# EAGLE design HIM-Otte-server-slow-control-V1-3a (EAGLE 7.7.0)
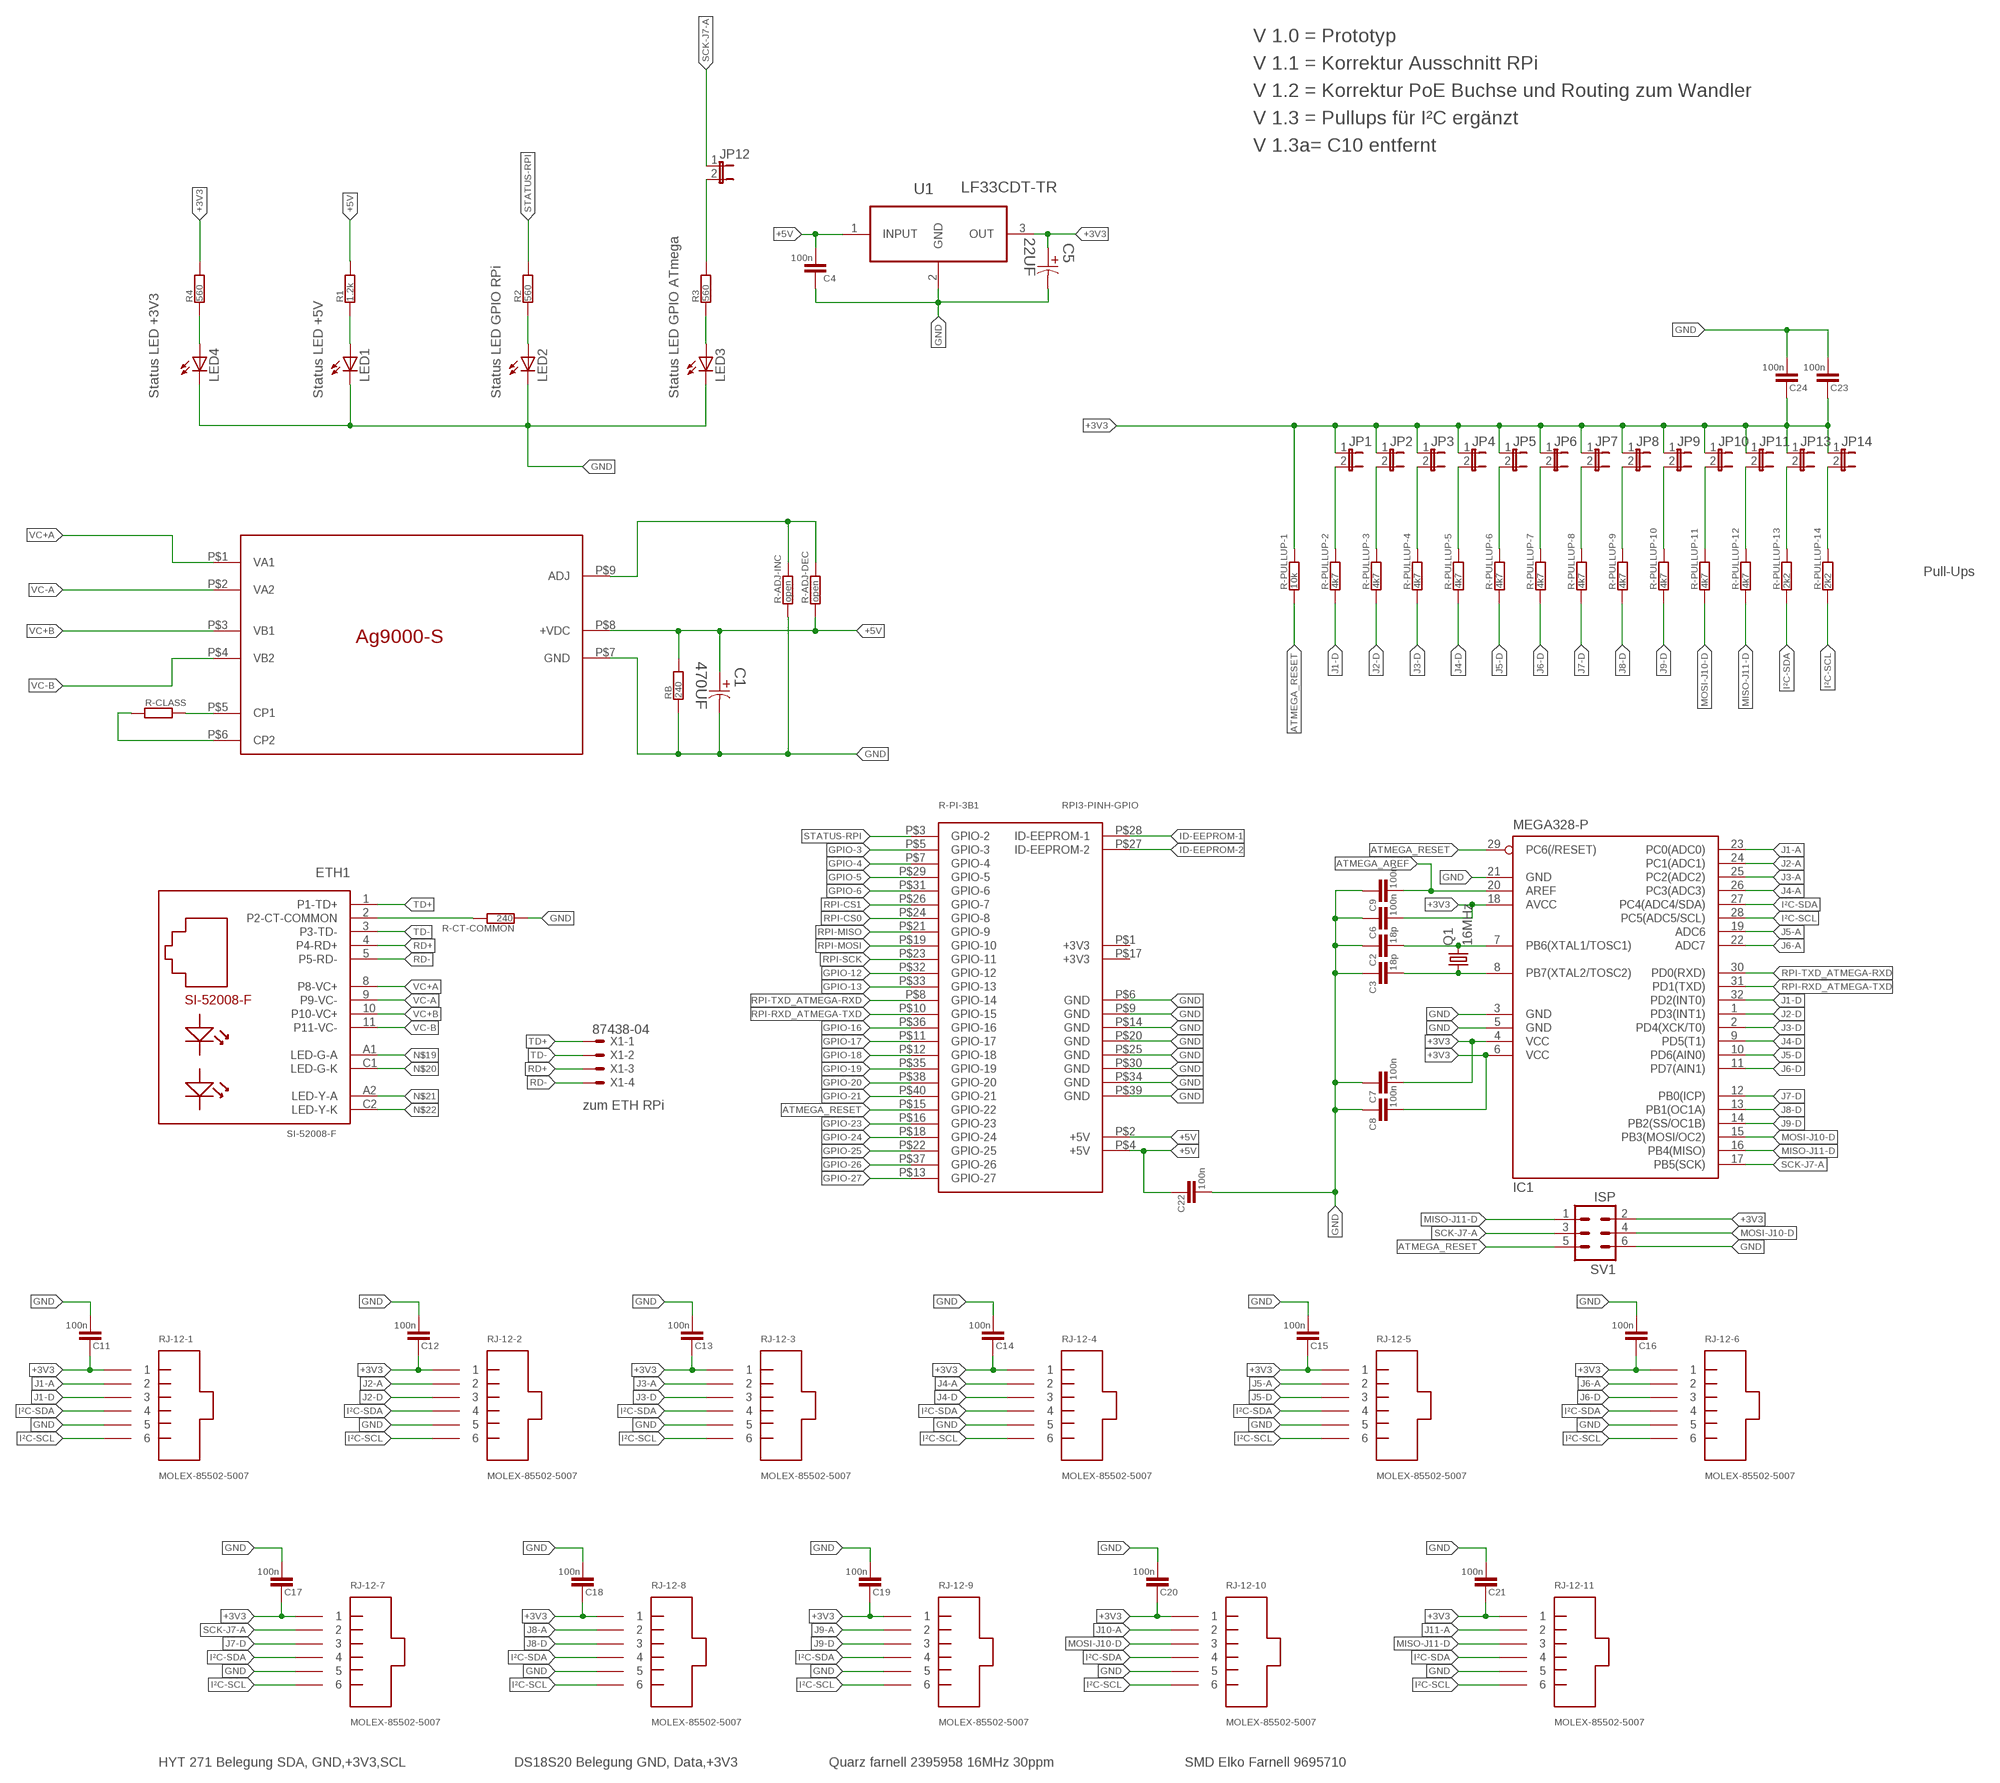
[diagram p0: schematic, sheet 1]

## Parts
C1  470UF  EEE-FK1C471P-CASE-F  [CAPAE830X1050N]
C2  18p  C-EUC0603  [C0603]
C3  18p  C-EUC0603  [C0603]
C4  100n  C-EUC0603  [C0603]
C5  22UF  EEE-FK1V220AR-CASE-C  [CAPAE530X610N]
C6  100n  C-EUC0603  [C0603]
C7  100n  C-EUC0603  [C0603]
C8  100n  C-EUC0603  [C0603]
C9  100n  C-EUC0603  [C0603]
C11  100n  C-EUC0603  [C0603]
C12  100n  C-EUC0603  [C0603]
C13  100n  C-EUC0603  [C0603]
C14  100n  C-EUC0603  [C0603]
C15  100n  C-EUC0603  [C0603]
C16  100n  C-EUC0603  [C0603]
C17  100n  C-EUC0603  [C0603]
C18  100n  C-EUC0603  [C0603]
C19  100n  C-EUC0603  [C0603]
C20  100n  C-EUC0603  [C0603]
C21  100n  C-EUC0603  [C0603]
C22  100n  C-EUC0603  [C0603]
C23  100n  C-EUC0603  [C0603]
C24  100n  C-EUC0603  [C0603]
ETH1  SI-52008-F  [SI-52008-F]
IC1  MEGA328-P  MEGA8-AI  [TQFP32-08]
JP1  JP1E  [JP1]
JP2  JP1E  [JP1]
JP3  JP1E  [JP1]
JP4  JP1E  [JP1]
JP5  JP1E  [JP1]
JP6  JP1E  [JP1]
JP7  JP1E  [JP1]
JP8  JP1E  [JP1]
JP9  JP1E  [JP1]
JP10  JP1E  [JP1]
JP11  JP1E  [JP1]
JP12  JP1E  [JP1]
JP13  JP1E  [JP1]
JP14  JP1E  [JP1]
LED1  LEDCHIPLED_0603  [CHIPLED_0603]
LED2  LEDCHIPLED_0603  [CHIPLED_0603]
LED3  LEDCHIPLED_0603  [CHIPLED_0603]
LED4  LEDCHIPLED_0603  [CHIPLED_0603]
Q1  16MHz  CRYSTALHC49UP  [HC49UP]
R1  1.2k  R-EU_R0603  [R0603]
R2  560  R-EU_R0603  [R0603]
R3  560  R-EU_R0603  [R0603]
R4  560  R-EU_R0603  [R0603]
R-ADJ-DEC  open  R-EU_R0603  [R0603]
R-ADJ-INC  open  R-EU_R0603  [R0603]
R-CLASS  R-EU_R0603  [R0603]
R-CT-COMMON  240  R-EU_R0603  [R0603]
R-PI-3B1  RPI3-PINH-GPIO  [RPI3-PINH-GPIO]
R-PULLUP-1  10k  R-EU_R0603  [R0603]
R-PULLUP-2  4k7  R-EU_R0603  [R0603]
R-PULLUP-3  4k7  R-EU_R0603  [R0603]
R-PULLUP-4  4k7  R-EU_R0603  [R0603]
R-PULLUP-5  4k7  R-EU_R0603  [R0603]
R-PULLUP-6  4k7  R-EU_R0603  [R0603]
R-PULLUP-7  4k7  R-EU_R0603  [R0603]
R-PULLUP-8  4k7  R-EU_R0603  [R0603]
R-PULLUP-9  4k7  R-EU_R0603  [R0603]
R-PULLUP-10  4k7  R-EU_R0603  [R0603]
R-PULLUP-11  4k7  R-EU_R0603  [R0603]
R-PULLUP-12  4k7  R-EU_R0603  [R0603]
R-PULLUP-13  2k2  R-EU_R0603  [R0603]
R-PULLUP-14  2k2  R-EU_R0603  [R0603]
RB  240  R-EU_R0603  [R0603]
RJ-12-1  MOLEX-85502-5007  [MOLEX-85502-5007]
RJ-12-2  MOLEX-85502-5007  [MOLEX-85502-5007]
RJ-12-3  MOLEX-85502-5007  [MOLEX-85502-5007]
RJ-12-4  MOLEX-85502-5007  [MOLEX-85502-5007]
RJ-12-5  MOLEX-85502-5007  [MOLEX-85502-5007]
RJ-12-6  MOLEX-85502-5007  [MOLEX-85502-5007]
RJ-12-7  MOLEX-85502-5007  [MOLEX-85502-5007]
RJ-12-8  MOLEX-85502-5007  [MOLEX-85502-5007]
RJ-12-9  MOLEX-85502-5007  [MOLEX-85502-5007]
RJ-12-10  MOLEX-85502-5007  [MOLEX-85502-5007]
RJ-12-11  MOLEX-85502-5007  [MOLEX-85502-5007]
SV1  ISP  ML6  [ML6]
U1  LF33CDT-TR  [TO228P972X240-3N]
U$1  AG9000-S  [AG9000-S]
X1  87438-04  [87438-04]

## Nets
+3V3: C5.1 C6.2 C7.2 C8.2 C11.1 C12.1 C13.1 C14.1 C15.1 C16.1 C17.1 C18.1 C19.1 C20.1 C21.1 C23.1 C24.1 IC1.4(VCC) IC1.6(VCC) IC1.18(AVCC) JP1.1 JP2.1 JP3.1 JP4.1 JP5.1 JP6.1 JP7.1 JP8.1 JP9.1 JP10.1 JP11.1 JP13.1 JP14.1 R4.2 R-PULLUP-1.2 RJ-12-1.1 RJ-12-2.1 RJ-12-3.1 RJ-12-4.1 RJ-12-5.1 RJ-12-6.1 RJ-12-7.1 RJ-12-8.1 RJ-12-9.1 RJ-12-10.1 RJ-12-11.1 SV1.2 U1.3(OUT)
+5V: C1.1 C4.2 C22.1 R1.2 R-ADJ-DEC.1 R-PI-3B1.P$2(+5V) R-PI-3B1.P$4(+5V) RB.2 U1.1(INPUT) U$1.P$8(+VDC)
ATMEGA_AREF: C9.2 IC1.20(AREF)
ATMEGA_RESET: IC1.29(PC6(/RESET)) R-PI-3B1.P$15(GPIO-22) R-PULLUP-1.1 SV1.5
GND: C1.2 C2.1 C3.1 C4.1 C5.2 C6.1 C7.1 C8.1 C9.1 C11.2 C12.2 C13.2 C14.2 C15.2 C16.2 C17.2 C18.2 C19.2 C20.2 C21.2 C22.2 C23.2 C24.2 IC1.3(GND) IC1.5(GND) IC1.21(GND) LED1.C LED2.C LED3.C LED4.C R-ADJ-INC.1 R-CT-COMMON.1 R-PI-3B1.P$6(GND) R-PI-3B1.P$9(GND) R-PI-3B1.P$14(GND) R-PI-3B1.P$20(GND) R-PI-3B1.P$25(GND) R-PI-3B1.P$30(GND) R-PI-3B1.P$34(GND) R-PI-3B1.P$39(GND) RB.1 RJ-12-1.5 RJ-12-2.5 RJ-12-3.5 RJ-12-4.5 RJ-12-5.5 RJ-12-6.5 RJ-12-7.5 RJ-12-8.5 RJ-12-9.5 RJ-12-10.5 RJ-12-11.5 SV1.6 U1.2(GND) U$1.P$7(GND)
GPIO-3: R-PI-3B1.P$5(GPIO-3)
GPIO-4: R-PI-3B1.P$7(GPIO-4)
GPIO-5: R-PI-3B1.P$29(GPIO-5)
GPIO-6: R-PI-3B1.P$31(GPIO-6)
GPIO-12: R-PI-3B1.P$32(GPIO-12)
GPIO-13: R-PI-3B1.P$33(GPIO-13)
GPIO-16: R-PI-3B1.P$36(GPIO-16)
GPIO-17: R-PI-3B1.P$11(GPIO-17)
GPIO-18: R-PI-3B1.P$12(GPIO-18)
GPIO-19: R-PI-3B1.P$35(GPIO-19)
GPIO-20: R-PI-3B1.P$38(GPIO-20)
GPIO-21: R-PI-3B1.P$40(GPIO-21)
GPIO-23: R-PI-3B1.P$16(GPIO-23)
GPIO-24: R-PI-3B1.P$18(GPIO-24)
GPIO-25: R-PI-3B1.P$22(GPIO-25)
GPIO-26: R-PI-3B1.P$37(GPIO-26)
GPIO-27: R-PI-3B1.P$13(GPIO-27)
ID-EEPROM-1: R-PI-3B1.P$28(ID-EEPROM-1)
ID-EEPROM-2: R-PI-3B1.P$27(ID-EEPROM-2)
I²C-SCL: IC1.28(PC5(ADC5/SCL)) R-PULLUP-14.1 RJ-12-1.6 RJ-12-2.6 RJ-12-3.6 RJ-12-4.6 RJ-12-5.6 RJ-12-6.6 RJ-12-7.6 RJ-12-8.6 RJ-12-9.6 RJ-12-10.6 RJ-12-11.6
I²C-SDA: IC1.27(PC4(ADC4/SDA)) R-PULLUP-13.1 RJ-12-1.4 RJ-12-2.4 RJ-12-3.4 RJ-12-4.4 RJ-12-5.4 RJ-12-6.4 RJ-12-7.4 RJ-12-8.4 RJ-12-9.4 RJ-12-10.4 RJ-12-11.4
J1-A: IC1.23(PC0(ADC0)) RJ-12-1.2
J1-D: IC1.32(PD2(INT0)) R-PULLUP-2.1 RJ-12-1.3
J2-A: IC1.24(PC1(ADC1)) RJ-12-2.2
J2-D: IC1.1(PD3(INT1)) R-PULLUP-3.1 RJ-12-2.3
J3-A: IC1.25(PC2(ADC2)) RJ-12-3.2
J3-D: IC1.2(PD4(XCK/T0)) R-PULLUP-4.1 RJ-12-3.3
J4-A: IC1.26(PC3(ADC3)) RJ-12-4.2
J4-D: IC1.9(PD5(T1)) R-PULLUP-5.1 RJ-12-4.3
J5-A: IC1.19(ADC6) RJ-12-5.2
J5-D: IC1.10(PD6(AIN0)) R-PULLUP-6.1 RJ-12-5.3
J6-A: IC1.22(ADC7) RJ-12-6.2
J6-D: IC1.11(PD7(AIN1)) R-PULLUP-7.1 RJ-12-6.3
J7-D: IC1.12(PB0(ICP)) R-PULLUP-8.1 RJ-12-7.3
J8-A: RJ-12-8.2
J8-D: IC1.13(PB1(OC1A)) R-PULLUP-9.1 RJ-12-8.3
J9-A: RJ-12-9.2
J9-D: IC1.14(PB2(SS/OC1B)) R-PULLUP-10.1 RJ-12-9.3
J10-A: RJ-12-10.2
J11-A: RJ-12-11.2
MISO-J11-D: IC1.16(PB4(MISO)) R-PULLUP-12.1 RJ-12-11.3 SV1.1
MOSI-J10-D: IC1.15(PB3(MOSI/OC2)) R-PULLUP-11.1 RJ-12-10.3 SV1.4
N$1: JP11.2 R-PULLUP-12.2
N$2: JP10.2 R-PULLUP-11.2
N$3: JP9.2 R-PULLUP-10.2
N$4: JP8.2 R-PULLUP-9.2
N$5: R-CLASS.2 U$1.P$5(CP1)
N$6: R-CLASS.1 U$1.P$6(CP2)
N$7: R-ADJ-DEC.2 R-ADJ-INC.2 U$1.P$9(ADJ)
N$8: C2.2 IC1.7(PB6(XTAL1/TOSC1)) Q1.2
N$9: C3.2 IC1.8(PB7(XTAL2/TOSC2)) Q1.1
N$10: JP7.2 R-PULLUP-8.2
N$11: ETH1.2(P2-CT-COMMON) R-CT-COMMON.2
N$12: JP6.2 R-PULLUP-7.2
N$13: JP5.2 R-PULLUP-6.2
N$14: JP4.2 R-PULLUP-5.2
N$15: JP3.2 R-PULLUP-4.2
N$16: JP2.2 R-PULLUP-3.2
N$17: JP1.2 R-PULLUP-2.2
N$18: LED4.A R4.1
N$19: ETH1.A1(LED-G-A)
N$20: ETH1.C1(LED-G-K)
N$21: ETH1.A2(LED-Y-A)
N$22: ETH1.C2(LED-Y-K)
N$23: JP12.2 R3.2
N$24: JP13.2 R-PULLUP-13.2
N$25: JP14.2 R-PULLUP-14.2
N$56: LED1.A R1.1
N$57: LED2.A R2.1
N$58: LED3.A R3.1
RD+: ETH1.4(P4-RD+) X1.3
RD-: ETH1.5(P5-RD-) X1.4
RPI-CS0: R-PI-3B1.P$24(GPIO-8)
RPI-CS1: R-PI-3B1.P$26(GPIO-7)
RPI-MISO: R-PI-3B1.P$21(GPIO-9)
RPI-MOSI: R-PI-3B1.P$19(GPIO-10)
RPI-RXD_ATMEGA-TXD: IC1.31(PD1(TXD)) R-PI-3B1.P$10(GPIO-15)
RPI-SCK: R-PI-3B1.P$23(GPIO-11)
RPI-TXD_ATMEGA-RXD: IC1.30(PD0(RXD)) R-PI-3B1.P$8(GPIO-14)
SCK-J7-A: IC1.17(PB5(SCK)) JP12.1 RJ-12-7.2 SV1.3
STATUS-RPI: R2.2 R-PI-3B1.P$3(GPIO-2)
TD+: ETH1.1(P1-TD+) X1.1
TD-: ETH1.3(P3-TD-) X1.2
VC+A: ETH1.8(P8-VC+) U$1.P$1(VA1)
VC+B: ETH1.10(P10-VC+) U$1.P$3(VB1)
VC-A: ETH1.9(P9-VC-) U$1.P$2(VA2)
VC-B: ETH1.11(P11-VC-) U$1.P$4(VB2)
Unconnected: R-PI-3B1.P$1(+3V3) R-PI-3B1.P$17(+3V3)

## Notes on the sheet
- V 1.0 = Prototyp
- V 1.1 = Korrektur Ausschnitt RPi
- V 1.2 = Korrektur PoE Buchse und Routing zum Wandler
- V 1.3 = Pullups für I²C ergänzt
- V 1.3a= C10 entfernt
- Status LED +3V3 | Status LED +5V | Status LED GPIO RPi | Status LED GPIO ATmega
- Pull-Ups
- zum ETH RPi
- HYT 271 Belegung SDA, GND,+3V3,SCL | DS18S20 Belegung GND, Data,+3V3 | Quarz farnell 2395958 16MHz 30ppm | SMD Elko Farnell 9695710

## Library data of the parts
C1 = Panasonic-EEEFK_EEEFP:EEE-: Aluminum Electrolytic Capacitors,Surface Mount Type; MPN: EEE-FK1C471P; OC_FARNELL: 9695710; OC_NEWARK: 96K9385; PACKAGE: CASE-F; SUPPLIER: PANASONIC; TOLERANCE: ±20 %; VOLTAGERATING: 16V
C2-C4 C6-C9 C11-C24 = KPH-RCL:C-EU: CAPACITOR, European symbol; DIELECTRICUM: X7R; HEIGHT: 0.6; TK: 100ppm; TOLERANCE: 10%; VOLTAGE: 16V
C5 = KPH-Panasonic-Elkos-SMD:EEE-: Aluminum Electrolytic Capacitors,Surface Mount Type; MPN: EEE-FK1V220AR; OC_FARNELL: 1244422; OC_NEWARK: 12M9846; PACKAGE: CASE-C; SUPPLIER: PANASONIC; TOLERANCE: ±20 %; VOLTAGERATING: 35V
ETH1 = KPH-con-stewart:SI-52008-F
IC1 = atmel:MEGA8: MICROCONTROLLER 8 Kbytes FLASH, 1 kbytes SRAM, 512 bytes EEPROM, USART, 6-channel 10 bit ADC, 2-channel 8 bit ADC Pin compatible with Atmega48, ATMega88, ATMega168 Source: avr.lbr; MPN: ATMEGA8-16AU; OC_FARNELL: 9171371; OC_NEWARK: 73M8863
JP1-JP14 = jumper:JP1E: JUMPER
LED1-LED4 = led:LED: LED OSRAM: - CHIPLED LG R971, LG N971, LY N971, LG Q971, LY Q971, LO R971, LY R971 LH N974, LH R974 LS Q976, LO Q976, LY Q976 LO Q996 - Hyper CHIPLED LW Q18S LB Q993, LB Q99A, LB R99A - SideLED LS A670, LO A670, LY A670, LG A670, LP A670 LB A673, LV A673, LT A673, LW A673 LH A674 LY A675 LS A676, LA A676, LO A676, LY A676, LW A676 LS A679, LY A679, LG A679 - Hyper Micro SIDELED® LS Y876, LA Y876, LO Y876, LY Y876 LT Y87S - SmartLED LW L88C, LW L88S LB L89C, LB L89S, LG L890 LS L89K, LO L89K, LY L89K LS L896, LA L896, LO L896, LY L896 - TOPLED LS T670, LO T670, LY T670, LG T670, LP T670 LSG T670, LSP T670, LSY T670, LOP T670, LYG T670 LG T671, LOG T671, LSG T671 LB T673, LV T673, LT T673, LW T673 LH T674 LS T676, LA T676, LO T676, LY T676, LB T676, LH T676, LSB T676, LW T676 LB T67C, LV T67C, LT T67C, LS T67K, LO T67K, LY T67K, LW E67C LS E67B, LA E67B, LO E67B, LY E67B, LB E67C, LV E67C, LT E67C LW T67C LS T679, LY T679, LG T679 LS T770, LO T770, LY T770, LG T770, LP T770 LB T773, LV T773, LT T773, LW T773 LH T774 LS E675, LA E675, LY E675, LS T675 LS T776, LA T776, LO T776, LY T776, LB T776 LHGB T686 LT T68C, LB T68C - Hyper Mini TOPLED® LB M676 - Mini TOPLED Santana® LG M470 LS M47K, LO M47K, LY M47K Source: http://www.osram.convergy.de LUXEON: - LUMILED® LXK2-PW12-R00, LXK2-PW12-S00, LXK2-PW14-U00, LXK2-PW14-V00 LXK2-PM12-R00, LXK2-PM12-S00, LXK2-PM14-U00 LXK2-PE12-Q00, LXK2-PE12-R00, LXK2-PE12-S00, LXK2-PE14-T00, LXK2-PE14-U00 LXK2-PB12-K00, LXK2-PB12-L00, LXK2-PB12-M00, LXK2-PB14-N00, LXK2-PB14-P00, LXK2-PB14-Q00 LXK2-PR12-L00, LXK2-PR12-M00, LXK2-PR14-Q00, LXK2-PR14-R00 LXK2-PD12-Q00, LXK2-PD12-R00, LXK2-PD12-S00 LXK2-PH12-R00, LXK2-PH12-S00 LXK2-PL12-P00, LXK2-PL12-Q00, LXK2-PL12-R00 Source: www.luxeon.com KINGBRIGHT: KA-3528ASYC Source: www.kingbright.com
Q1 = crystal:CRYSTAL: CRYSTAL; OC_FARNELL: unknown; OC_NEWARK: unknown
R1-R4 R-ADJ-DEC R-ADJ-INC R-CLASS R-CT-COMMON R-PULLUP-1-R-PULLUP-14 RB = KPH-RCL:R-EU_: RESISTOR, European symbol; HEIGHT: 0.2; TK: 100ppm; TOLERANCE: 1%
R-PI-3B1 = KPH-Raspberry:RPI3-PINH-GPIO
RJ-12-1-RJ-12-11 = RJ12:MOLEX-85502-5007
SV1 = con-harting-ml:ML6: HARTING; OC_FARNELL: unknown; OC_NEWARK: unknown
U1 = KPH-V-REG:LF33CDT-TR: LDO, REG, 16VIN, 3.3V, 1A, D-PAK-3; MPN: LF33CDT-TR; OC_FARNELL: 2112623; OC_NEWARK: 89K1285; PACKAGE: DPAK; SUPPLIER: STMicroelectronics
U$1 = KPH-PoE-Netzteil:AG9000-S: PoE Ag9000-S
X1 = con-molex:87438-04: Wire-to-Board 1.50mm (.059") Pitch Header - Right Angle, SMT, Shrouded Source: http://www.molex.com/product/micro/87438.html; OC_FARNELL: unknown; OC_NEWARK: unknown

## Net classes
0 default: width 0.4 mm, drill 0.6 mm, clearance 0.2 mm

## Board
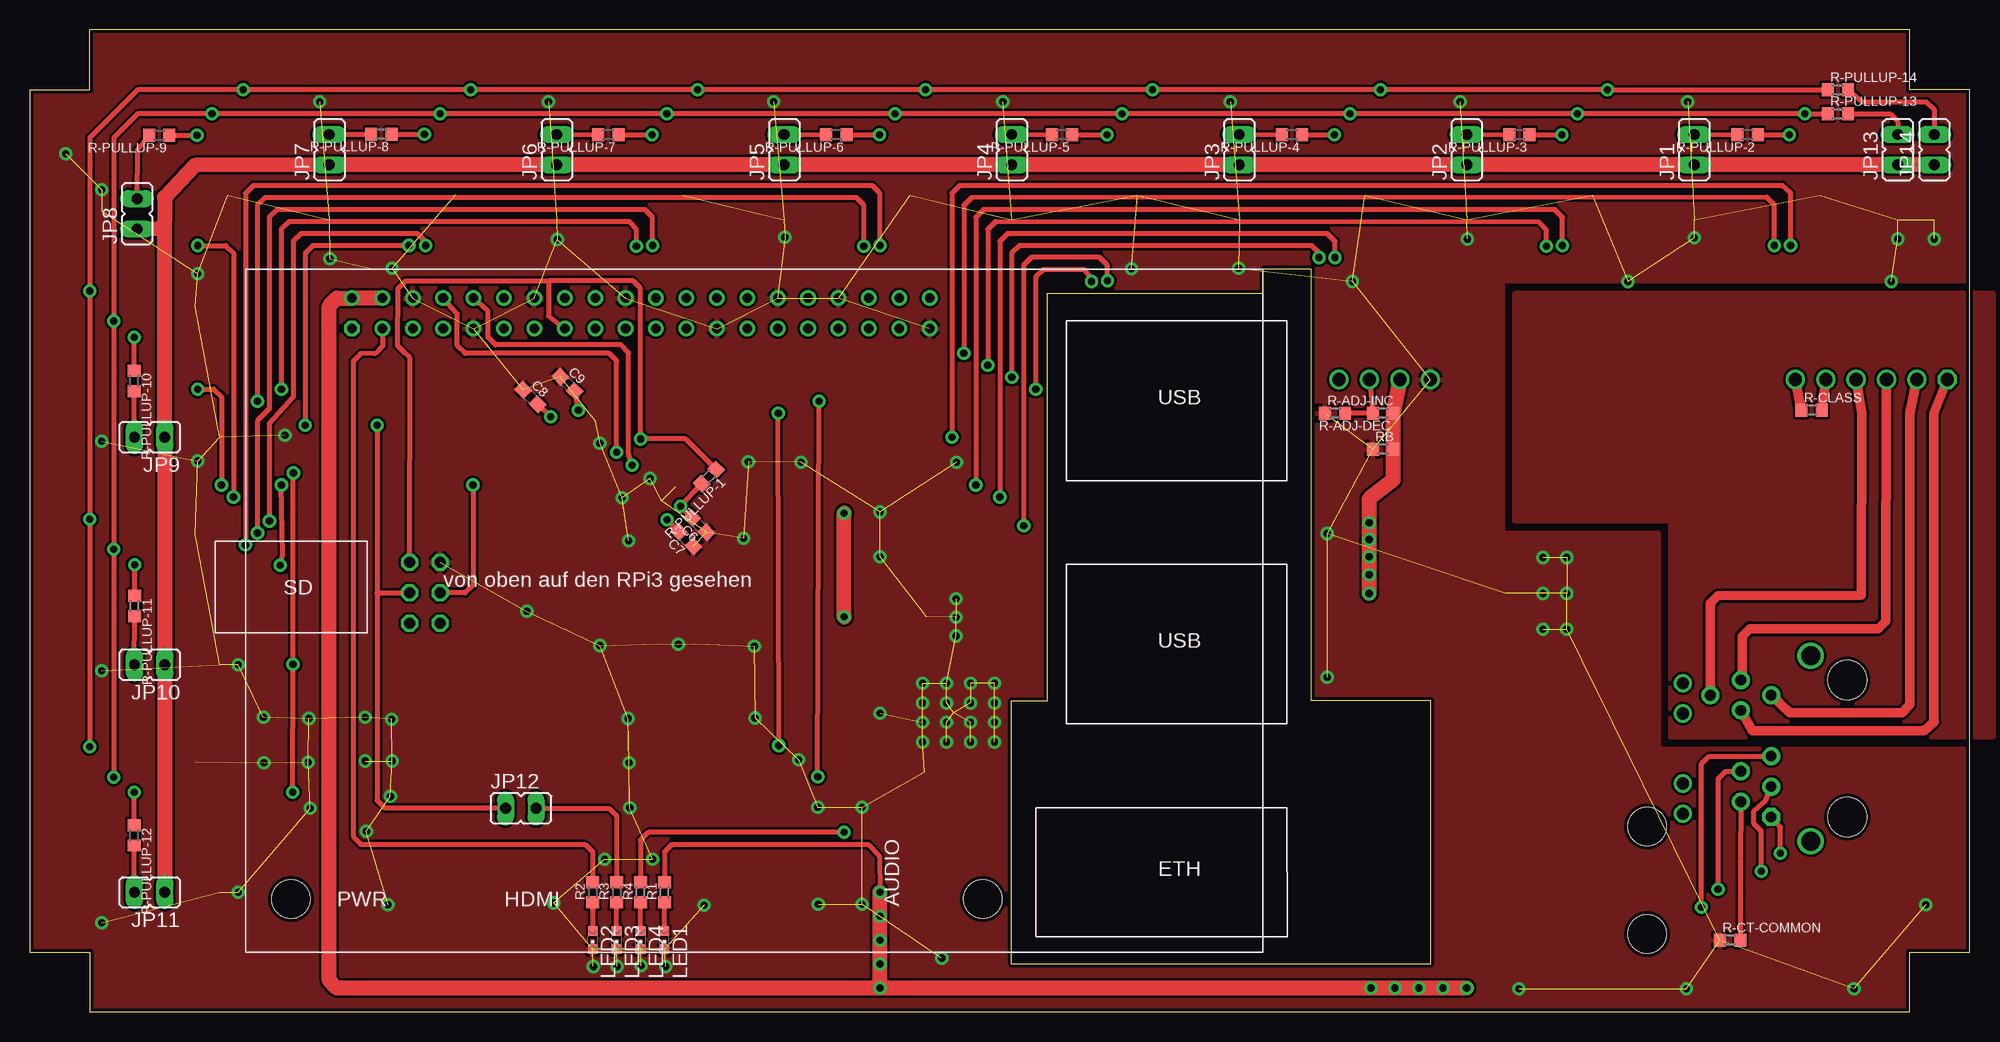
[diagram p1: board, top side]
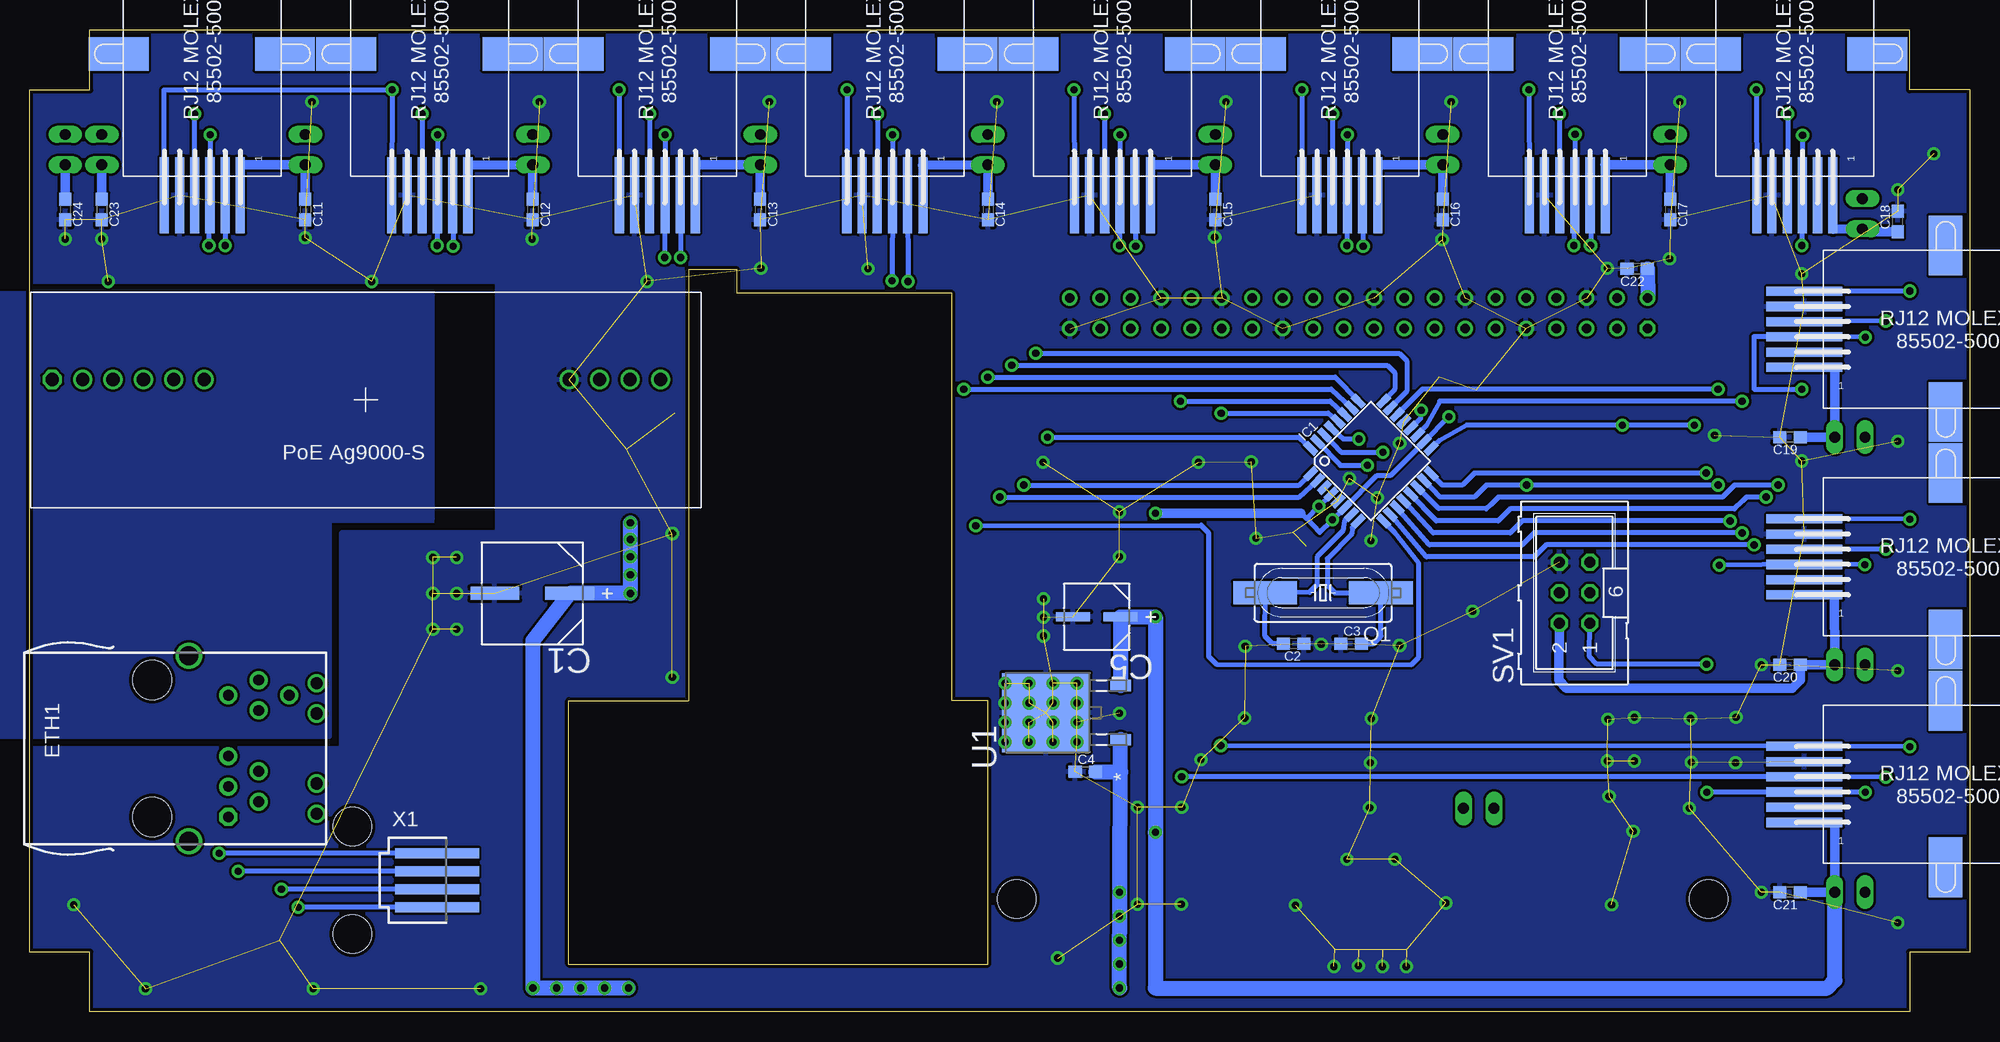
[diagram p2: board, bottom side, seen from below]

Size 162 x 82 mm. Coordinates in mm from the lower left corner, seen from the top.
Outline: 5,0 157,0 157,5 162,5 162,77 157,77 157,82 5,82 5,77 0,77 0,5 5,5 5,0
Outline: 82,4 82,26 85,26 85,60 103,60 103,62 107,62 107,26 117,26 117,4 82,4
Copper layers (1*16): Top 0.035mm / dielectric 1.5mm / Bottom 0.035mm
Design rules "LPKF": minimum track width 0.15mm, minimum drill 0.5mm, track to track 0.21mm, track to pad 0.21mm, pad to pad 0.15mm, via to via 0.21mm, smd to smd 0.15mm, copper to edge 0.3mm, drill to drill 0.2mm, minimum pad ring 0.25mm, minimum via ring 0.25mm, stop-mask expansion 0.075mm, vias tented up to drill 0mil, thermal gap 0.25mm
Holes 3.2 mm at 135.05,15.5 135.05,6.5
bRestrict: area 124,41 to 128,60

### Footprints (pad centres in the part's own frame; a part is rotated, then mirrored left to right if it is on the bottom)
CAPAE830X1050N = smd 4.064 x 1.092: 1 -3.124,0; 2 3.124,0
C0603 = smd 1.1 x 1: 1 -0.85,0; 2 0.85,0
CAPAE530X610N = smd 2.87 x 0.762: 1 -1.981,0; 2 1.981,0
SI-52008-F = drill 0.9 pad 1.5 octagon: 1 5.715,4.572 | drill 0.9 pad 1.5: 2 4.445,7.112; 3 3.175,4.572; 4 1.905,7.112; 5 0.635,4.572; 8 -3.175,7.112; 9 -4.445,4.572; 10 -5.715,7.112; 11 -4.445,9.652 | drill 1.016 pad 1.5: A1 -5.461,11.938; A2 2.921,11.938; C1 -2.921,11.938; C2 5.461,11.938 | drill 1.6 pad 2.2: S1 -7.747,1.27; S2 7.747,1.27 | hole 3.251: -5.715,-1.778; 5.715,-1.778
TQFP32-08 = smd 1.27 x 0.559: 1 -4.293,2.8; 2 -4.293,2; 3 -4.293,1.2; 4 -4.293,0.4; 5 -4.293,-0.4; 6 -4.293,-1.2; 7 -4.293,-2; 8 -4.293,-2.8; 17 4.293,-2.8; 18 4.293,-2; 19 4.293,-1.2; 20 4.293,-0.4; 21 4.293,0.4; 22 4.293,1.2; 23 4.293,2; 24 4.293,2.8 | smd 0.559 x 1.27: 9 -2.8,-4.293; 10 -2,-4.293; 11 -1.2,-4.293; 12 -0.4,-4.293; 13 0.4,-4.293; 14 1.2,-4.293; 15 2,-4.293; 16 2.8,-4.293; 25 2.8,4.293; 26 2,4.293; 27 1.2,4.293; 28 0.4,4.293; 29 -0.4,4.293; 30 -1.2,4.293; 31 -2,4.293; 32 -2.8,4.293
JP1 = drill 0.914 long: 1 0,-1.27; 2 0,1.27
CHIPLED_0603 = smd 0.8 x 0.8: A 0,-0.75; C 0,0.75
HC49UP = smd 5.334 x 1.93: 1 -4.826,0; 2 4.826,0
R0603 = smd 1 x 1.1: 1 -0.85,0; 2 0.85,0
RPI3-PINH-GPIO = drill 0.8 octagon: P$1 8.89,52.07 | drill 0.8: P$2 8.89,54.61; P$3 11.43,52.07; P$4 11.43,54.61; P$5 13.97,52.07; P$6 13.97,54.61; P$7 16.51,52.07; P$8 16.51,54.61; P$9 19.05,52.07; P$10 19.05,54.61; P$11 21.59,52.07; P$12 21.59,54.61; P$13 24.13,52.07; P$14 24.13,54.61; P$15 26.67,52.07; P$16 26.67,54.61; P$17 29.21,52.07; P$18 29.21,54.61; P$19 31.75,52.07; P$20 31.75,54.61; P$21 34.29,52.07; P$22 34.29,54.61; P$23 36.83,52.07; P$24 36.83,54.61; P$25 39.37,52.07; P$26 39.37,54.61; P$27 41.91,52.07; P$28 41.91,54.61; P$29 44.45,52.07; P$30 44.45,54.61; P$31 46.99,52.07; P$32 46.99,54.61; P$33 49.53,52.07; P$34 49.53,54.61; P$35 52.07,52.07; P$36 52.07,54.61; P$37 54.61,52.07; P$38 54.61,54.61; P$39 57.15,52.07; P$40 57.15,54.61 | hole 3.2: 3.81,4.445; 61.595,4.445
MOLEX-85502-5007 = smd 6.35 x 0.76: 1 8.8,3.175; 2 8.8,1.905; 3 8.8,0.635; 4 8.8,-0.635; 5 8.8,-1.905; 6 8.8,-3.175 | smd 2.8 x 5: 7 -3,6.9; 8 -3,-7
ML6 = drill 0.914 octagon: 1 -2.54,-1.27; 2 -2.54,1.27; 3 0,-1.27; 4 0,1.27; 5 2.54,-1.27; 6 2.54,1.27
TO228P972X240-3N = smd 0.94 x 1.702: 1 -2.261,-6.096; 3 2.261,-6.096 | smd 6.604 x 7.315: 2 0,0.152
AG9000-S = drill 1.1 octagon: P$1 -26.14,1.81 | drill 1.1: P$2 -23.6,1.81; P$3 -21.06,1.81; P$4 -18.52,1.81; P$5 -15.98,1.81; P$6 -13.44,1.81; P$7 17.04,1.81; P$8 19.58,1.81; P$9 22.12,1.81; P$10 24.66,1.81
87438-04 = smd 7 x 0.85: 1 0,2.25; 2 0,0.75; 3 0,-0.75; 4 0,-2.25

### Placement (x,y rotation side)
C1  120.05,34.95 180 bottom
C2  56.45,30.75 180 bottom
C3  51.65,30.75 0 bottom
C4  73.85,20.05 0 bottom
C5  72.9,33 180 bottom
C6  55.9,40.65 135 top
C7  54.8,39.5 135 top
C8  41.8,51.35 315 top
C9  44.9,52.45 315 top
C11  139,67 270 bottom
C12  120,67 270 bottom
C13  101,67 270 bottom
C14  82,67 270 bottom
C15  63,67 270 bottom
C16  44,67 270 bottom
C17  25,67 270 bottom
C18  6,66 90 bottom
C19  15,48 180 bottom
C20  15,29 180 bottom
C21  15,10 180 bottom
C22  27.75,62.05 180 bottom
C23  156,67 270 bottom
C24  159.05,67 270 bottom
ETH1  150,22 270 bottom
IC1  50,46 45 bottom
JP1  139,72 0 top
JP2  120,72 0 top
JP3  101,72 0 top
JP4  82,72 0 top
JP5  63,72 0 top
JP6  44,72 0 top
JP7  25,72 0 top
JP8  8.95,66.65 0 top
JP9  10,48 90 top
JP10  10,29 90 top
JP11  10,10 90 top
JP12  41,17 270 top
JP13  156,72 0 top
JP14  159.05,72 0 top
LED1  53,6 180 top
LED2  47,6 180 top
LED3  49,6 180 top
LED4  51,6 180 top
Q1  54,35 180 bottom
R1  53,10 90 top
R2  47,10 90 top
R3  49,10 90 top
R4  51,10 90 top
R-ADJ-DEC  113,50 180 top
R-ADJ-INC  109,50 0 top
R-CLASS  148.8,50.25 0 top
R-CT-COMMON  142,6 0 top
R-PI-3B1  18,5 0 top
R-PULLUP-1  56.7,44.7 225 top
R-PULLUP-2  143.45,73.25 180 top
R-PULLUP-3  124.4,73.25 180 top
R-PULLUP-4  105.4,73.25 180 top
R-PULLUP-5  86.2,73.25 180 top
R-PULLUP-6  67.35,73.25 180 top
R-PULLUP-7  48.3,73.25 180 top
R-PULLUP-8  29.35,73.3 180 top
R-PULLUP-9  10.8,73.2 180 top
R-PULLUP-10  8.7,52.7 270 top
R-PULLUP-11  8.75,33.9 270 top
R-PULLUP-12  8.7,14.75 270 top
R-PULLUP-13  151,75 0 top
R-PULLUP-14  151,77 0 top
RB  113,47 0 top
RJ-12-1  147.6,77 270 bottom
RJ-12-2  128.6,77 270 bottom
RJ-12-3  109.6,77 270 bottom
RJ-12-4  90.6,77 270 bottom
RJ-12-5  71.6,77 270 bottom
RJ-12-6  52.6,77 270 bottom
RJ-12-7  33.6,77 270 bottom
RJ-12-8  14.6,77 270 bottom
RJ-12-9  5,57 180 bottom
RJ-12-10  5,38 180 bottom
RJ-12-11  5,19 180 bottom
SV1  33,35 90 bottom
U1  77,25 90 bottom
U$1  134,51 0 bottom
X1  128,11 0 bottom

### Tracks (layer width: path | path; a pad name or v marks a point on that pad's centre or on a via)
+3V3  (via drill 0.6)
  Top 0.406: 11.25,66 11.25,65.35 | C6.2 v54.35,42.22 R-PULLUP-1.2 | v53.23,41.1 C7.2 | v43.5,49.7 C8.2 | v68,15 51.63,15 51,14.37 R4.2 | 139,70.75 JP1.1
  Top 1.27: JP1.1 JP2.1 JP3.1 JP4.1 JP5.1 JP6.1 JP7.1 13.75,70.7 11.25,68.05 11.25,66 JP9.1 JP10.1 JP11.1 | 11.25,65.35 JP8.1 | v68,33 v68,41.65 | JP14.1 JP13.1 153,70.73 150,70.75 139,70.75
  Bottom 0.406: 144.45,70.75 RJ-12-1.1 | 125.45,70.7 RJ-12-2.1 | 106.4,70.75 RJ-12-3.1 | 87.45,70.7 RJ-12-4.1 | 68.4,70.75 RJ-12-5.1 | 49.4,70.75 RJ-12-6.1 | 30.45,70.75 RJ-12-7.1 | 11.4,65.35 RJ-12-8.1 | 11.25,53.85 RJ-12-9.1 | 11.3,34.85 RJ-12-10.1 | 11.25,15.8 RJ-12-11.1 | 55.85,41.65 55.35,41.2 | 55.35,41.2 v54.35,42.22 IC1.4 | 55.35,41.2 54.3,40.05 v53.23,41.1 IC1.6 49.49,44.81 49.2,44.81 48.32,44.83 IC1.18 v43.5,49.7
  Bottom 0.813: 144.45,70.75 JP1.1 C11.1 | 125.45,70.7 JP2.1 C12.1 | 106.4,70.75 JP3.1 C13.1 | 87.45,70.7 JP4.1 C14.1 | 68.4,70.75 JP5.1 C15.1 | 49.4,70.75 JP6.1 C16.1 | 30.45,70.75 JP7.1 C17.1 | 11.4,65.35 JP8.1 9,65.15 C18.1 | 11.25,53.85 JP9.1 C19.1 | 11.3,34.85 JP10.1 C20.1 14.15,27.68 14.79,27.05 33.66,27.05 34.3,27.69 SV1.2 | 11.25,15.8 JP11.1 C21.1 | v68,41.65 55.85,41.65 | C23.1 JP13.1 | C24.1 JP14.1
  Bottom 1.27: U1.3 C5.1 v68,33 v68,15 68,2 11.89,2 11.25,2.64 JP11.1
+5V  (via drill 0.6)
  Top 0.406: R1.2 53,13.37 53.63,14 70,14 70.95,13 v71,10
  Top 1.27: U$1.P$8 R-ADJ-DEC.1 RB.2 113.85,44.4 111.85,42.85 v111.85,34.95 | R-PI-3B1.P$4 R-PI-3B1.P$2 25.63,59.6 25,58.97 25,2.63 25.64,2 v71,2 | v120,2 v71,2 | v71,2 v71,4 v71,6 v71,8 v71,10
  Bottom 1.27: v71,2 70.92,20.05 | 70.92,20.05 U1.1 | C4.2 70.92,20.05 | C22.1 R-PI-3B1.P$2 | v111.85,40.85 v111.85,39.45 v111.85,38 v111.85,36.5 v111.85,34.95 C1.1 120,31 v120,2 v118,2 v116,2 v114,2 v112,2
ATMEGA_AREF  (via drill 0.6)
  Top 0.406: C9.2 v45.8,50.25
  Bottom 0.406: v45.8,50.25 45.85,49.55 IC1.20
ATMEGA_RESET  (via drill 0.6)
  Top 0.406: SV1.5 31.75,54.62 31.37,54.98 30.71,55.62 30.75,60.42 31.38,61.05 43.3,61.05 | 43.3,61.05 43.3,58.1 R-PI-3B1.P$15 | 43.3,61.05 50.37,61.05 51,60.41 v51,47.85 54.75,47.85 R-PULLUP-1.1
  Bottom 0.406: IC1.29 52.3,47.85 v51,47.85
GND  (via drill 0.6)  (160 unrouted)
  other vias: 54.15,30.7 47.6,47.5 49.45,42.95 51.8,44.55 50,39.35 47.6,30.6 60.5,30.55 59.6,39.55 6,7.45 6,28.5 6,47.65 6,68.65 14,61.65 3,71.65 24.2,76 43.3,76 62.1,76 81.25,76 100.25,76 119.45,76 138.45,76 156,64.55 17.4,10 17.4,29 21.3,48.15 14,46 25.05,62.9 30.25,62.1 44.05,64.5 63.05,64.7 92,62.05 100.95,62.1 120.05,64.55 139,64.65 155.45,61 110.45,61 133.45,61 47.05,3.8 49.05,3.8 51.05,3.85 53.1,3.8 48,12.75 52,12.75 29.9,8.95 43.75,9.1 19.55,20.8 23.25,20.85 28,20.95 30.25,20.95 19.5,24.6 23.3,24.5 28,24.6 30.2,24.45 28.1,15.1 23.4,17 30.1,18 50.1,17.05 65.8,17.1 69.5,17.1 65.85,9 69.5,9 56.3,8.9 71,24.95 71,38 64.2,21.05 50.05,20.8 49.95,24.5 60.55,24.55 41.5,33.45 76.55,22.55 77.35,32.95 77.35,34.5 77.35,31.4 74.55,27.45 76.55,27.45 78.55,27.45 80.55,27.45 74.55,22.55 76.55,25.8 74.55,25.8 80.55,24.2 78.55,24.2 76.55,24.2 74.55,24.2 80.55,22.55 78.55,22.55 76.15,4.5 60,45.95 64.4,45.9 77.4,45.9 71,41.75 108.35,39.95 108.35,27.95 126.35,37.95 126.35,34.95 126.35,31.95 128.35,31.95 128.35,34.95 128.35,37.95 124.35,1.95 138.35,1.95 152.35,1.95 158.35,8.95 78.55,25.8 80.55,25.8 159.05,64.55
  pour Bottom: -4,84 166,84 166,61 123,61 123,40 136,40 136,22 166,22 166,-1 -4,-1
  pour Top: -2,84 164,84 164,61 123,61 123,40 136,40 136,22 164,22 164,-1 -2,-1
GND-PRI
  pour Bottom: 166,60 128,60 128,41 137,41 137,23 166,23
  pour Top: 164,60 124,60 124,41 137,41 137,23 164,23
I²C-SCL  (via drill 0.6)
  Top 0.406: v5,22.15 v5,41.15 v5,60.2 5,73 9,77 v17.8,77 v36.8,77 v55.75,77 v74.8,77 v93.75,77 v112.8,77 v131.75,77 R-PULLUP-14.1 | v62.55,22.25 v62.5,50
  Bottom 0.406: RJ-12-1.6 150.8,77 v131.75,77 RJ-12-2.6 | v112.8,77 RJ-12-3.6 | v93.75,77 RJ-12-4.6 | v74.8,77 RJ-12-5.6 | v55.75,77 RJ-12-6.6 | v36.8,77 RJ-12-7.6 | v17.8,77 RJ-12-8.6 | v5,60.2 RJ-12-9.6 | v5,41.15 RJ-12-10.6 | v5,22.15 RJ-12-11.6 v62.55,22.25 | v62.5,50 53.55,50 IC1.28
I²C-SDA  (via drill 0.6)
  Top 0.406: v7,19.6 v7,38.65 v7,57.7 7,73 9,75 v15.2,75 v34.25,75 v53.2,75 v72.25,75 v91.2,75 v110.25,75 v129.25,75 v148.25,75 R-PULLUP-13.1 | v65.8,19.65 v65.9,51
  Bottom 0.406: RJ-12-1.4 v148.25,75 | v129.25,75 RJ-12-2.4 | v110.25,75 RJ-12-3.4 | v91.2,75 RJ-12-4.4 | v72.25,75 RJ-12-5.4 | v53.2,75 RJ-12-6.4 | v34.25,75 RJ-12-7.4 | v15.2,75 RJ-12-8.4 | v7,57.7 RJ-12-9.4 | v7,38.65 RJ-12-10.4 | v7,19.6 RJ-12-11.4 v65.8,19.65 | v65.9,51 53.4,51 IC1.27
J1-A  (via drill 0.6)
  Top 0.406: v145.7,64 145.71,67.42 145.07,68.05 78.64,68 78,67.36 v78,55
  Bottom 0.406: RJ-12-1.2 v145.7,64 | v78,55 47.63,55 47,54.37 47,51.85 IC1.23
J1-D  (via drill 0.6)
  Top 0.406: R-PULLUP-2.1 v146.95,73.25 | v147.05,64 147.05,68.36 146.37,69 77.64,69 77,68.36 v77,48
  Bottom 0.406: v146.95,73.25 RJ-12-1.3 v147.05,64 | v77,48 56,48 IC1.32
J2-A  (via drill 0.6)
  Top 0.406: v126.65,63.95 126.65,65.32 126.07,65.95 80.64,66 80,65.36 v80,54
  Bottom 0.406: RJ-12-2.2 v126.65,63.95 | v80,54 48.63,54 48,53.37 48,52 IC1.24
J2-D  (via drill 0.6)
  Top 0.406: R-PULLUP-3.1 v127.95,73.25 | v128,64 128,66.36 127.36,67 79.64,67 79,66.36 v79,44
  Bottom 0.406: v127.95,73.25 RJ-12-2.3 v128,64 | v79,44 56,44 IC1.1
J3-A  (via drill 0.6)
  Top 0.406: v107.65,63 107.7,63.37 107.06,64 82.64,64 82,63.37 v82,53
  Bottom 0.406: RJ-12-3.2 v107.65,63 | v82,53 53,53 IC1.25
J3-D  (via drill 0.6)
  Top 0.406: R-PULLUP-4.1 v108.95,73.25 | v109,63 109,64.36 108.36,65 81.64,65 81,64.36 v81,43
  Bottom 0.406: v108.95,73.25 RJ-12-3.3 v109,63 | v81,43 56,43 IC1.2
J4-A  (via drill 0.6)
  Top 0.406: v88.65,61 88.6,61.32 88.07,61.96 84.64,61.99 84,61.36 v84,52
  Bottom 0.406: RJ-12-4.2 v88.65,61 | v84,52 53.3,52 IC1.26
J4-D  (via drill 0.6)
  Top 0.406: R-PULLUP-5.1 v89.95,73.25 | v90,61.05 89.98,62.35 89.35,63 83.64,63 83,62.37 v83,40.6
  Bottom 0.406: v89.95,73.25 RJ-12-4.3 v90,61.05 | v83,40.6 64.19,40.65 63.55,40.01 63.55,29.68 62.92,29.05 46.64,29 46,29.64 46,37.45 48,40 IC1.9
J5-A  (via drill 0.6)
  Top 0.406: v69.65,63.95 69.66,67.37 69.02,68 19.64,68 19,67.36 v19,51
  Bottom 0.406: RJ-12-5.2 v69.65,63.95 | v19,51 44.25,51 45.35,49 IC1.19
J5-D  (via drill 0.6)
  Top 0.406: R-PULLUP-6.1 v70.95,73.25 | v71,64 71,68.36 70.36,69 18.64,69 18,68.36 v18,39
  Bottom 0.406: v70.95,73.25 RJ-12-5.3 v71,64 | v18,39 35.37,39 36,38.37 36.37,38 45.35,38 IC1.10
J6-A  (via drill 0.6)
  Top 0.406: v50.65,63.95 50.65,65.36 50.06,66 21.64,66 21,65.36 v21,52
  Bottom 0.406: RJ-12-6.2 v50.65,63.95 | v21,52 45.7,52 IC1.22
J6-D  (via drill 0.6)
  Top 0.406: R-PULLUP-7.1 v51.95,73.25 | v52,64 52,66.36 51.37,67 20.64,67 20,66.36 20,50.37 19,49.37 v19,40
  Bottom 0.406: v51.95,73.25 RJ-12-6.3 v52,64 | v19,40 36.37,40 37.37,39 45.1,39 IC1.11
J7-D  (via drill 0.6)
  Top 0.406: R-PULLUP-8.1 v32.95,73.3 | v33.05,64 33,64.36 32.37,65 22.64,65 22,64.36 22,51.37 20,49.16 v20,41
  Bottom 0.406: v32.95,73.3 RJ-12-7.3 v33.05,64 | v20,41 37.37,41 38.37,40 44.8,40 IC1.12
J8-D  (via drill 0.6)
  Top 0.406: R-PULLUP-9.1 v13.95,73.2 | v14,64 16.36,64 17,63.37 v17,43
  Bottom 0.406: v13.95,73.2 RJ-12-8.3 v14,64 | v17,43 18.64,43 19,42.63 19.64,42 38.37,42 39,41.37 39.37,41 44.55,41 IC1.13
J9-D  (via drill 0.6)
  Top 0.406: R-PULLUP-10.1 v8.7,56.35 | v14,52 15.37,52 16,51.37 v16,44
  Bottom 0.406: v8.7,56.35 RJ-12-9.3 18,56.4 18,52 v14,52 | v16,44 19.64,44 20,43.63 20.64,43 39.37,43 40,42.37 40.37,42 44.35,42.05 IC1.14
MISO-J11-D  (via drill 0.6)
  Top 0.406: R-PULLUP-12.1 v8.7,18.35 | v21.95,18.35 v21.97,29.02 v22,45
  Bottom 0.406: v8.7,18.35 RJ-12-11.3 v21.95,18.35 | v21.97,29.02 31.11,29.05 31.75,29.69 SV1.1 | v22,45 41.37,45 42.37,44 44.05,44 IC1.16
MOSI-J10-D  (via drill 0.6)
  Top 0.406: R-PULLUP-11.1 v8.75,37.35 | v20.9,37.3 21.1,38.15 v21,44 | v37,44 37,35.63 36.37,35 SV1.4
  Bottom 0.406: v8.75,37.35 RJ-12-10.3 v20.9,37.3 | v21,44 v37,44 40.37,44 41.37,43 44.2,43 IC1.15
N$1
  Top 0.406: JP11.2 R-PULLUP-12.2
N$2
  Top 0.406: JP10.2 R-PULLUP-11.2
N$3
  Top 0.406: JP9.2 R-PULLUP-10.2
N$4
  Top 0.406: JP8.2 9,72 R-PULLUP-9.2
N$5
  Top 0.813: R-CLASS.2 U$1.P$5
N$6
  Top 0.813: R-CLASS.1 U$1.P$6
N$7
  Top 0.406: U$1.P$9 R-ADJ-DEC.2 R-ADJ-INC.2
N$8
  Bottom 0.406: C2.2 58.21,30.75 58.85,31.39 Q1.2 55.13,35.04 54.5,35.68 54.5,38 52.35,40.2 52.2,41 IC1.7
N$9
  Bottom 0.406: C3.2 49.79,30.75 49.15,31.39 Q1.1 53.02,35 53.65,35.63 53.65,37.85 51.6,39.95 51.55,40.45 IC1.8
N$10
  Top 0.406: JP7.2 R-PULLUP-8.2
N$11
  Top 0.406: ETH1.2 142.85,12.55 R-CT-COMMON.2
N$12
  Top 0.406: JP6.2 R-PULLUP-7.2
N$13
  Top 0.406: JP5.2 R-PULLUP-6.2
N$14
  Top 0.406: JP4.2 R-PULLUP-5.2
N$15
  Top 0.406: JP3.2 R-PULLUP-4.2
N$16
  Top 0.406: JP2.2 R-PULLUP-3.2
N$17
  Top 0.406: JP1.2 R-PULLUP-2.2
N$18
  Top 0.406: LED4.A R4.1
N$23
  Top 0.406: JP12.2 48.37,17 49,16.36 R3.2
N$24
  Top 0.406: R-PULLUP-13.2 155.37,75 156,74.36 JP13.2
N$25
  Top 0.406: R-PULLUP-14.2 153.05,76 158.37,76 159.05,75.36 JP14.2
N$56
  Top 0.406: LED1.A R1.1
N$57
  Top 0.406: R2.1 LED2.A
N$58
  Top 0.406: LED3.A R3.1
RD+  (via drill 0.6)
  Top 0.406: v141,10.25 141,19.46 141.64,20.1 ETH1.4
  Bottom 0.406: X1.3 v141,10.25
RD-  (via drill 0.6)
  Top 0.406: v139.6,8.75 139.6,20.72 140.23,21.35 ETH1.5
  Bottom 0.406: X1.4 v139.6,8.75
RPI-RXD_ATMEGA-TXD  (via drill 0.6)
  Top 0.406: v50.3,45.65 50,46.55 50,55.06 49.37,55.7 38.88,55.7 38.25,56.34 38.25,58.5 R-PI-3B1.P$10
  Bottom 0.406: IC1.31 52.55,45.65 v50.3,45.65
RPI-TXD_ATMEGA-RXD  (via drill 0.6)
  Top 0.406: v49,46.75 49,54.37 48.37,55 36.34,55 35.7,55.63 35.7,58.3 R-PI-3B1.P$8
  Bottom 0.406: IC1.30 52.5,46.75 v49,46.75
SCK-J7-A  (via drill 0.6)
  Top 0.406: v31.65,64 23.64,64 23,63.37 v23,49 | v29,49 29,35 | 29,35 SV1.3 | 29,35 29,17.67 29.64,17.04 39.73,17.04 JP12.1
  Bottom 0.406: RJ-12-7.2 v31.65,64 | v23,49 v29,49 42,49 44.3,47.7 IC1.17
STATUS-RPI
  Top 0.406: R-PI-3B1.P$3 29.48,55.62 28.83,54.96 27.65,54.99 27,54.35 27,14.63 27.64,14 46.37,14 47,13.37 R2.2
TD+  (via drill 0.6)
  Top 0.406: v146.2,13.25 146.2,15.45 ETH1.1
  Bottom 0.406: X1.1 v146.2,13.25
TD-  (via drill 0.6)
  Top 0.406: v144.6,11.75 144.6,15.1 144,15.7 144,16.8 145,17.7 ETH1.3
  Bottom 0.406: X1.2 v144.6,11.75
VC+A
  Top 0.406: 159.05,24.23 159,24.23
  Top 0.813: ETH1.8 143.85,23.5 158.22,23.5 159.05,24.23 | 159,24.23 159,50 U$1.P$1
VC+B
  Top 0.406: ETH1.10 143,28
  Top 0.813: 143,28 143,31.36 143.63,32 154.37,32 155,32.63 U$1.P$3
VC-A
  Top 0.813: ETH1.9 147,25 156.37,25 157,25.64 157,50 U$1.P$2
VC-B
  Top 0.813: ETH1.11 140.35,34.11 140.99,34.75 152.95,34.8 153,50 U$1.P$4

### Text on the board
Document: JGU TBE BE 06.07.2016
bDocu: RJ45-1 | RJ45-2 | RJ45-3 | RJ45-6